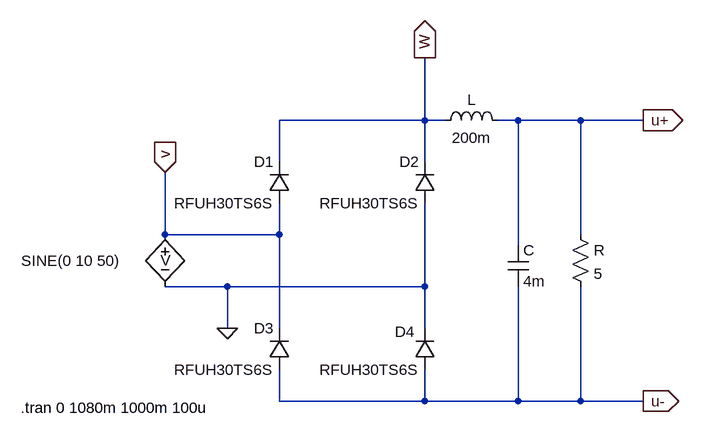
[diagram p0: schematic RedresseurLC.asc]
RedresseurLC.asc, the LTspice schematic file:
Version 4
SHEET 1 1032 680
WIRE 448 -112 448 -208
WIRE 448 -112 224 -112
WIRE 480 -112 448 -112
WIRE 592 -112 560 -112
WIRE 688 -112 592 -112
WIRE 784 -112 688 -112
WIRE 224 -48 224 -112
WIRE 448 -48 448 -112
WIRE 48 64 48 -32
WIRE 224 64 224 16
WIRE 224 64 48 64
WIRE 688 64 688 -112
WIRE 592 80 592 -112
WIRE 144 144 48 144
WIRE 448 144 448 16
WIRE 448 144 144 144
WIRE 144 208 144 144
WIRE 224 208 224 64
WIRE 448 208 448 144
WIRE 224 320 224 272
WIRE 448 320 448 272
WIRE 448 320 224 320
WIRE 592 320 592 144
WIRE 592 320 448 320
WIRE 688 320 688 144
WIRE 688 320 592 320
WIRE 784 320 688 320
FLAG 144 208 0
FLAG 448 -208 W
IOPIN 448 -208 Out
FLAG 784 -112 u+
IOPIN 784 -112 Out
FLAG 784 320 u-
IOPIN 784 320 Out
FLAG 48 -32 v
IOPIN 48 -32 In
SYMBOL diode 240 16 R180
WINDOW 0 24 64 Left 2
WINDOW 3 24 0 Left 2
SYMATTR InstName D1
SYMATTR Value RFUH30TS6S
SYMBOL diode 464 16 R180
WINDOW 0 24 64 Left 2
WINDOW 3 24 0 Left 2
SYMATTR InstName D2
SYMATTR Value RFUH30TS6S
SYMBOL diode 240 272 R180
WINDOW 0 24 64 Left 2
WINDOW 3 24 0 Left 2
SYMATTR InstName D3
SYMATTR Value RFUH30TS6S
SYMBOL ind 464 -96 R270
WINDOW 0 32 56 VTop 2
WINDOW 3 5 56 VBottom 2
SYMATTR InstName L
SYMATTR Value 200m
SYMBOL cap 576 80 R0
SYMATTR InstName C
SYMATTR Value 4m
SYMBOL res 672 48 R0
SYMATTR InstName R
SYMATTR Value 5
SYMBOL bv 48 48 R0
WINDOW 0 -7 55 Left 2
WINDOW 3 -221 56 Left 2
WINDOW 123 0 0 Left 0
WINDOW 39 0 0 Left 0
SYMATTR InstName V
SYMATTR Value SINE(0 10 50)
SYMATTR Prefix V
SYMBOL diode 464 272 R180
WINDOW 0 31 59 Left 2
WINDOW 3 24 0 Left 2
SYMATTR InstName D4
SYMATTR Value RFUH30TS6S
TEXT -174 330 Left 2 !.tran 0 1080m 1000m 100u

The netlist it stands for:
* RedresseurLC.asc
D1 v W RFUH30TS6S
D2 0 W RFUH30TS6S
D3 u- v RFUH30TS6S
L W u+ 200m
C u+ u- 4m
R u+ u- 5
V v 0 SINE(0 10 50)
D4 u- 0 RFUH30TS6S
.model D D
.lib standard.dio
.tran 0 1080m 1000m 100u
.backanno
.end

* Results of the author's LTspice run, read from the files saved beside the schematic
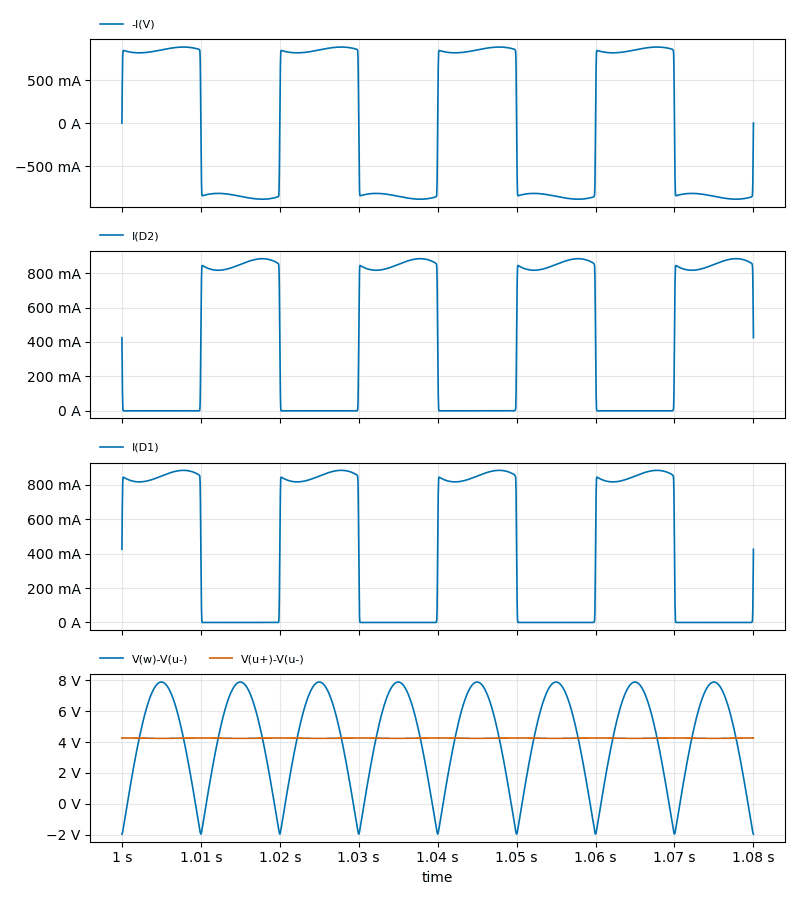
[diagram p1: Transient Analysis of RedresseurLC.asc, plotted from the saved traces]
* Transient Analysis, 1 run:
*   -I(V): min -883.8 mA, max 883.8 mA, average -2.138 µA, rms 845 mA, last 440.6 µA
*   I(D2): min -1.239 µA, max 883.8 mA, average 425.1 mA, rms 599.5 mA, last 424.9 mA
*   I(D1): min -1.291 µA, max 883.8 mA, average 425.1 mA, rms 599.5 mA, last 425.3 mA
*   V(w)-V(u-): min -1.951 V, max 7.881 V, average 4.249 V, rms 5.245 V, last -1.951 V
*   V(u+)-V(u-): min 4.238 V, max 4.266 V, average 4.251 V, rms 4.251 V, last 4.266 V